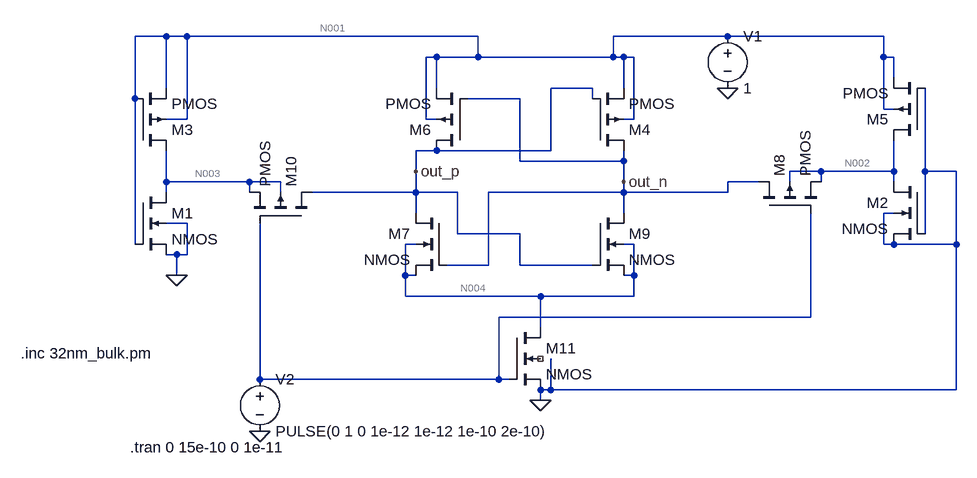
[diagram p0: schematic row_amplifaer.asc]
row_amplifaer.asc, the LTspice schematic file:
Version 4
SHEET 1 1524 724
WIRE -560 -224 -608 -224
WIRE -528 -224 -560 -224
WIRE -80 -224 -528 -224
WIRE 304 -224 128 -224
WIRE 544 -224 304 -224
WIRE -144 -192 -160 -192
WIRE -80 -192 -80 -224
WIRE -80 -192 -144 -192
WIRE 128 -192 128 -224
WIRE 128 -192 -80 -192
WIRE 144 -192 128 -192
WIRE 160 -192 144 -192
WIRE 544 -192 544 -224
WIRE 560 -192 544 -192
WIRE 560 -160 560 -192
WIRE -560 -144 -560 -224
WIRE -144 -144 -144 -192
WIRE 96 -144 32 -144
WIRE 144 -144 144 -192
WIRE -608 -128 -608 -224
WIRE -16 -128 -96 -128
WIRE 96 -128 96 -144
WIRE 544 -112 544 -192
WIRE 560 -112 544 -112
WIRE -528 -96 -528 -224
WIRE -528 -96 -560 -96
WIRE -160 -96 -160 -192
WIRE -144 -96 -160 -96
WIRE 160 -96 160 -192
WIRE 160 -96 144 -96
WIRE -144 -48 -176 -48
WIRE 32 -48 32 -144
WIRE 32 -48 -144 -48
WIRE -16 -32 -16 -128
WIRE 144 -32 144 -48
WIRE 144 -32 -16 -32
WIRE -176 -16 -176 -48
WIRE 448 -16 400 -16
WIRE 560 -16 560 -64
WIRE 560 -16 448 -16
WIRE 608 -16 608 -144
WIRE 656 -16 608 -16
WIRE -560 0 -560 -48
WIRE -432 0 -560 0
WIRE -384 0 -432 0
WIRE 144 0 144 -32
WIRE 352 0 304 0
WIRE 400 0 400 -16
WIRE 448 0 448 -16
WIRE 560 0 560 -16
WIRE -560 16 -560 0
WIRE -432 16 -432 0
WIRE -384 16 -384 0
WIRE -176 16 -176 -16
WIRE -176 16 -336 16
WIRE -112 16 -176 16
WIRE 144 16 144 0
WIRE 144 16 -64 16
WIRE 304 16 304 0
WIRE 304 16 144 16
WIRE -176 48 -176 16
WIRE 144 48 144 16
WIRE 560 48 544 48
WIRE -528 64 -560 64
WIRE -112 80 -112 16
WIRE -16 80 -112 80
WIRE 608 80 608 -16
WIRE -608 96 -608 -128
WIRE -176 96 -192 96
WIRE 160 96 144 96
WIRE 544 96 544 48
WIRE 560 96 544 96
WIRE 656 96 656 -16
WIRE 656 96 560 96
WIRE -544 112 -560 112
WIRE -528 112 -528 64
WIRE -528 112 -544 112
WIRE -64 128 -64 16
WIRE -64 128 -128 128
WIRE -16 128 -16 80
WIRE 96 128 -16 128
WIRE -544 144 -544 112
WIRE -192 144 -192 96
WIRE -176 144 -192 144
WIRE 160 144 160 96
WIRE 160 144 144 144
WIRE -192 176 -192 144
WIRE 16 176 -192 176
WIRE 160 176 160 144
WIRE 160 176 16 176
WIRE 432 208 432 48
WIRE 432 208 -48 208
WIRE 16 224 16 176
WIRE -416 304 -416 64
WIRE -48 304 -48 208
WIRE -48 304 -416 304
WIRE -32 304 -48 304
WIRE 32 320 32 272
WIRE 32 320 16 320
WIRE 656 320 656 96
WIRE 656 320 32 320
WIRE 16 336 16 320
FLAG -176 -16 out_p
FLAG 144 0 out_n
FLAG 16 336 0
FLAG 304 -144 0
FLAG -416 384 0
FLAG -544 144 0
SYMBOL voltage 304 -240 R0
WINDOW 123 0 0 Left 0
WINDOW 39 0 0 Left 0
SYMATTR InstName V1
SYMATTR Value 1
SYMBOL voltage -416 288 R0
WINDOW 123 0 0 Left 0
WINDOW 39 0 0 Left 0
SYMATTR InstName V2
SYMATTR Value PULSE(0 1 0 1e-12 1e-12 1e-10 2e-10)
SYMBOL nmos4 -608 16 R0
SYMATTR InstName M1
SYMATTR Value2 l=32e-9 w=320e-9 ad=51200e-18 as=51200e-18 pd=960e-9 ps=960e-9
SYMBOL nmos4 608 0 M0
SYMATTR InstName M2
SYMATTR Value2 l=32e-9 w=320e-9 ad=51200e-18 as=51200e-18 pd=960e-9 ps=960e-9
SYMBOL nmos4 -128 48 M0
SYMATTR InstName M7
SYMATTR Value2 l=32e-9 w=320e-9 ad=51200e-18 as=51200e-18 pd=960e-9 ps=960e-9
SYMBOL nmos4 96 48 R0
SYMATTR InstName M9
SYMATTR Value2 l=32e-9 w=320e-9 ad=51200e-18 as=51200e-18 pd=960e-9 ps=960e-9
SYMBOL nmos4 -32 224 R0
SYMATTR InstName M11
SYMATTR Value2 l=32e-9 w=320e-9 ad=51200e-18 as=51200e-18 pd=960e-9 ps=960e-9
SYMBOL pmos4 -608 -48 M180
SYMATTR InstName M3
SYMATTR Value2 l=32e-9 w=640e-9 ad=51200e-18 as=51200e-18 pd=960e-9 ps=960e-9
SYMBOL pmos4 96 -48 M180
SYMATTR InstName M4
SYMATTR Value2 l=32e-9 w=640e-9 ad=51200e-18 as=51200e-18 pd=960e-9 ps=960e-9
SYMBOL pmos4 608 -64 R180
SYMATTR InstName M5
SYMATTR Value2 l=32e-9 w=640e-9 ad=51200e-18 as=51200e-18 pd=960e-9 ps=960e-9
SYMBOL pmos4 -96 -48 R180
SYMATTR InstName M6
SYMATTR Value2 l=32e-9 w=640e-9 ad=51200e-18 as=51200e-18 pd=960e-9 ps=960e-9
SYMBOL pmos4 352 48 R270
SYMATTR InstName M8
SYMATTR Value2 l=32e-9 w=640e-9 ad=51200e-18 as=51200e-18 pd=960e-9 ps=960e-9
SYMBOL pmos4 -336 64 M270
SYMATTR InstName M10
SYMATTR Value2 l=32e-9 w=640e-9 ad=51200e-18 as=51200e-18 pd=960e-9 ps=960e-9
TEXT -616 408 Left 2 !.tran 0 15e-10 0 1e-11
TEXT -784 264 Left 2 !.inc 32nm_bulk.pm

The netlist it stands for:
* row_amplifaer.asc
V1 N001 0 1
V2 N005 0 PULSE(0 1 0 1e-12 1e-12 1e-10 2e-10)
M1 N003 N001 0 0 NMOS l=32e-9 w=320e-9 ad=51200e-18 as=51200e-18 pd=960e-9 ps=960e-9
M2 N002 0 0 0 NMOS l=32e-9 w=320e-9 ad=51200e-18 as=51200e-18 pd=960e-9 ps=960e-9
M7 out_p out_n N004 N004 NMOS l=32e-9 w=320e-9 ad=51200e-18 as=51200e-18 pd=960e-9 ps=960e-9
M9 out_n out_p N004 N004 NMOS l=32e-9 w=320e-9 ad=51200e-18 as=51200e-18 pd=960e-9 ps=960e-9
M11 N004 N005 0 NC_01 NMOS l=32e-9 w=320e-9 ad=51200e-18 as=51200e-18 pd=960e-9 ps=960e-9
M3 N003 N001 N001 N001 PMOS l=32e-9 w=640e-9 ad=51200e-18 as=51200e-18 pd=960e-9 ps=960e-9
M4 out_n out_p N001 N001 PMOS l=32e-9 w=640e-9 ad=51200e-18 as=51200e-18 pd=960e-9 ps=960e-9
M5 N002 0 N001 N001 PMOS l=32e-9 w=640e-9 ad=51200e-18 as=51200e-18 pd=960e-9 ps=960e-9
M6 out_p out_n N001 N001 PMOS l=32e-9 w=640e-9 ad=51200e-18 as=51200e-18 pd=960e-9 ps=960e-9
M8 out_n N005 N002 N002 PMOS l=32e-9 w=640e-9 ad=51200e-18 as=51200e-18 pd=960e-9 ps=960e-9
M10 out_p N005 N003 N003 PMOS l=32e-9 w=640e-9 ad=51200e-18 as=51200e-18 pd=960e-9 ps=960e-9
.model NMOS NMOS
.model PMOS PMOS
.lib standard.mos
.tran 0 15e-10 0 1e-11
.inc 32nm_bulk.pm
.backanno
.end

* Results of the author's LTspice run, read from the files saved beside the schematic
* Operating Point, zero values left out:
*   V(n001) = 1 V
*   V(n003) = 224.8 µV
*   V(n002) = 999.9 mV
*   V(out_p) = 179.4 mV
*   V(out_n) = 999.9 mV
*   V(n004) = 179.4 mV
*   Id(M10) = 107.3 nA
*   Is(M10) = -107.3 nA
*   Id(M8) = 16.59 nA
*   Ig(M8) = -84.56 pA
*   Is(M8) = -16.51 nA
*   Id(M6) = -62.62 nA
*   Ig(M6) = 18.34 pA
*   Is(M6) = 62.6 nA
*   Id(M5) = -99.35 nA
*   Ig(M5) = -84.58 pA
*   Is(M5) = 99.43 nA
*   Id(M4) = -63.31 nA
*   Ig(M4) = -36.69 pA
*   Is(M4) = 63.34 nA
*   Id(M3) = -224.3 nA
*   Ig(M3) = 42.15 pA
*   Ib(M3) = 1.023 pA
*   Is(M3) = 224.3 nA
*   Id(M11) = 2.056 nA
*   Ig(M11) = -3.525 pA
*   Is(M11) = -2.052 nA
*   Id(M9) = 44.66 nA
*   Ig(M9) = -660.3 pA
*   Is(M9) = -44 nA
*   Id(M7) = -43.98 nA
*   Ig(M7) = 2.033 nA
*   Is(M7) = 41.95 nA
*   Id(M2) = 115.9 nA
*   Ig(M2) = -1.813 nA
*   Ib(M2) = -1.018 pA
*   Is(M2) = -114 nA
*   Id(M1) = 331.6 nA
*   Ig(M1) = 6.033 nA
*   Is(M1) = -337.6 nA
*   I(V2) = 88.27 pA
*   I(V1) = -455.7 nA
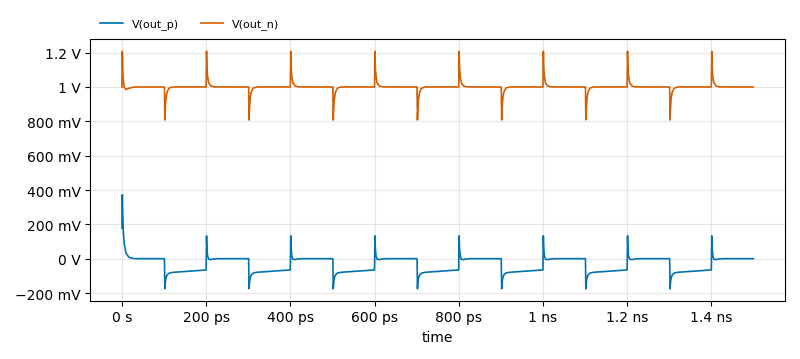
[diagram p1: Transient Analysis of row_amplifaer.asc, plotted from the saved traces]
* Transient Analysis, 1 run:
*   V(out_p): min -175.3 mV, max 372.5 mV, average -33.3 mV, rms 55.38 mV, last 390.4 µV
*   V(out_n): min 808 mV, max 1.208 V, average 1 V, rms 1 V, last 999.8 mV